# EAGLE design STorM32 NT motor v11 (EAGLE 6.5.0)
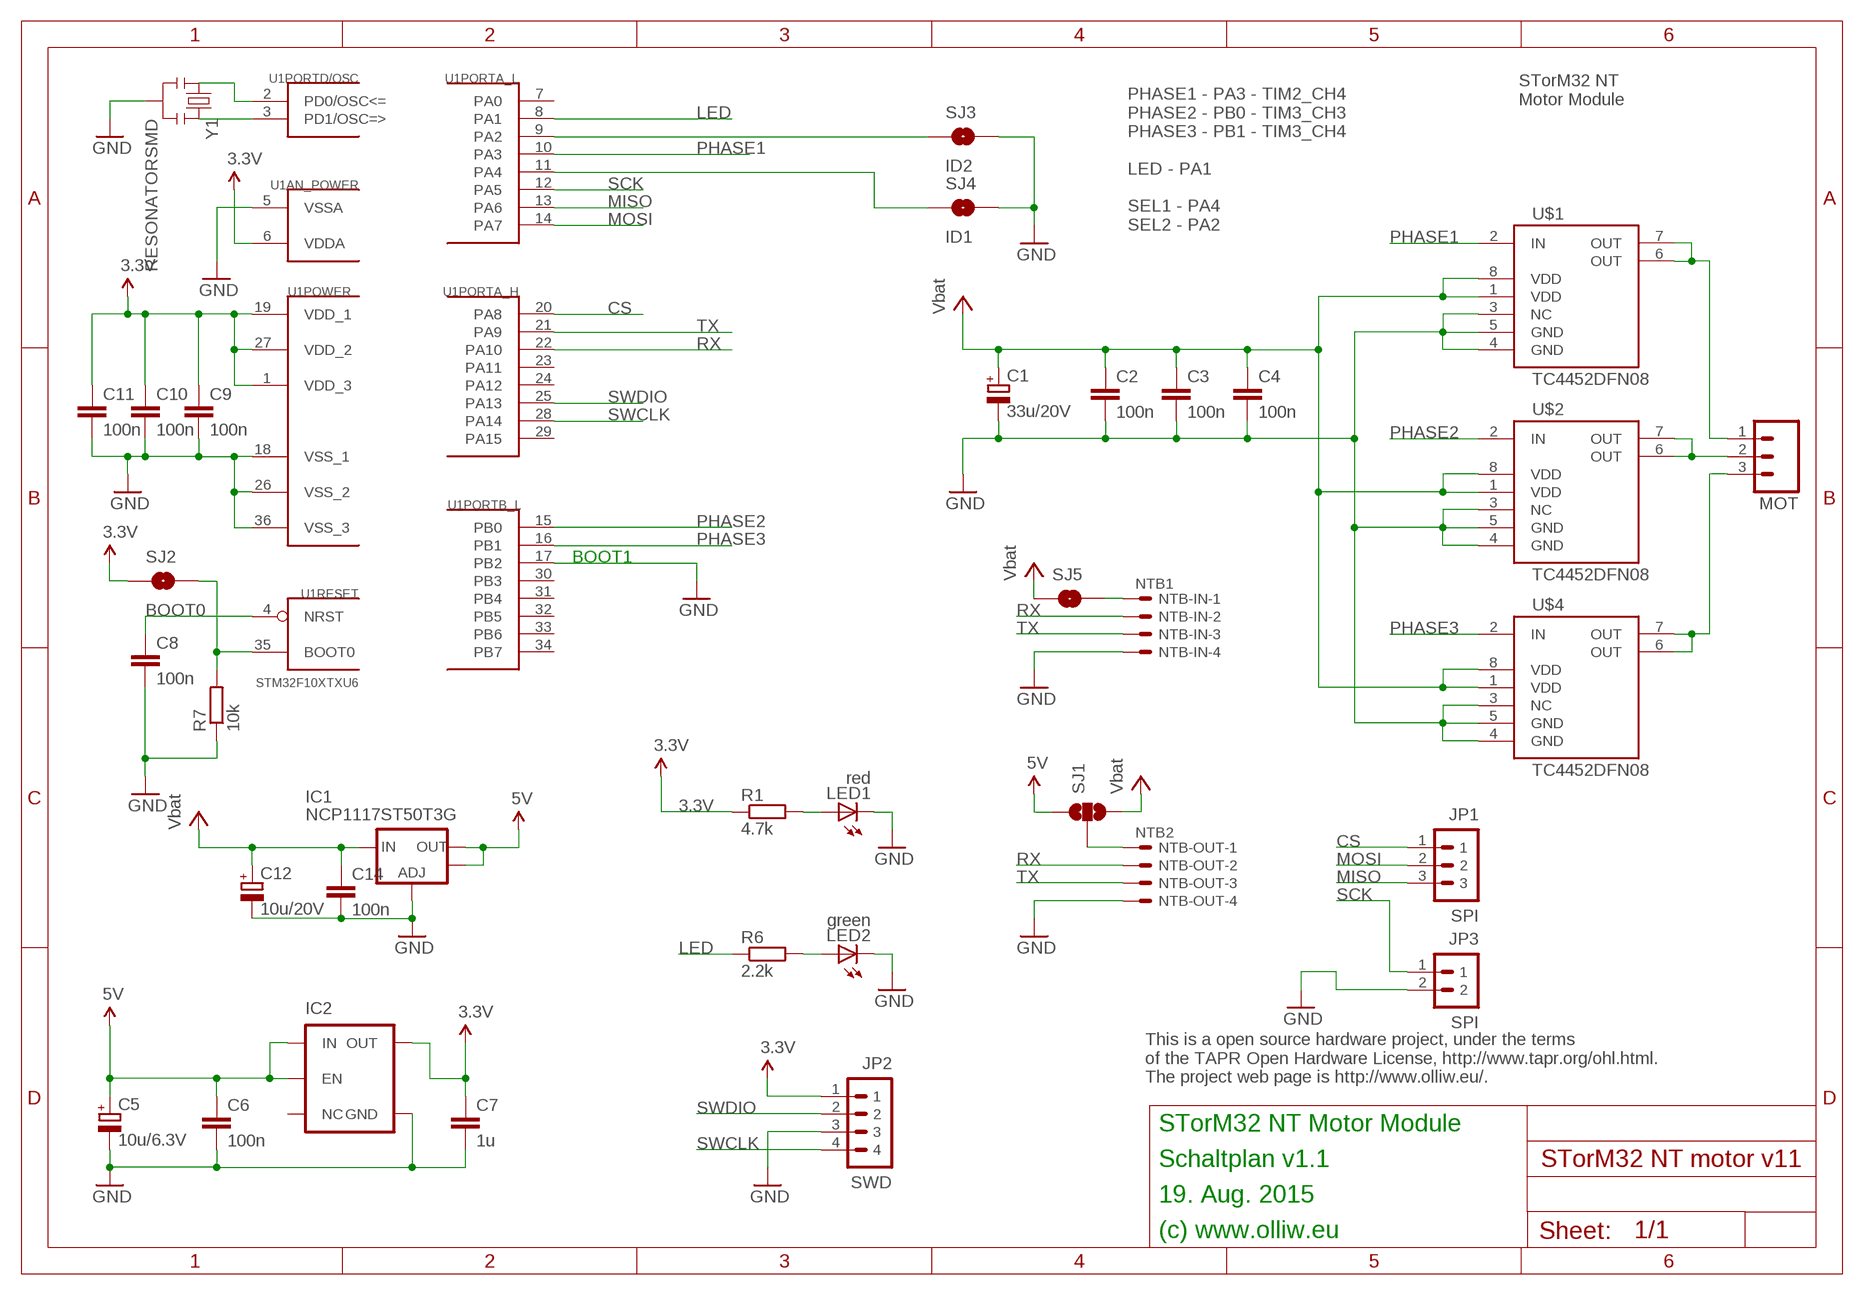
[diagram p0: schematic, sheet 1]

## Parts
C1  33u/20V  CPOL-EUSMCC  [SMC_C]
C2  100n  C-EUC0603  [C0603]
C3  100n  C-EUC0603  [C0603]
C4  100n  C-EUC0603  [C0603]
C5  10u/6.3V  CPOL-EUSMCB  [SMC_B]
C6  100n  C-EUC0603  [C0603]
C7  1u  C-EUC0603  [C0603]
C8  100n  C-EUC0603  [C0603]
C9  100n  C-EUC0603  [C0603]
C10  100n  C-EUC0603  [C0603]
C11  100n  C-EUC0603  [C0603]
C12  10u/20V  CPOL-EUSMCB  [SMC_B]
C14  100n  C-EUC0603  [C0603]
IC1  NCP1117ST50T3G  V_REG_LM1117SOT223  [SOT223]
IC2  V_REG_TPS76433SOT23-5  [SOT23-5]
JP1  SPI  P3X1_1P27-OCT_BILEX  [3X1_1P27_OCT_BILEX]
JP2  SWD  P4X1_1P27-OCT_BILEX  [4X1_1P27_OCT_BILEX]
JP3  SPI  P2X1_1P27-OCT_BILEX  [2X1_1P27_OCT_BILEX]
LED1  red  LEDCHIPLED_0603  [CHIPLED_0603]
LED2  green  LEDCHIPLED_0603  [CHIPLED_0603]
MOT  M03PTH  [1X03]
NTB-IN  NTB1  SM04B-SRSS-TB  [SM04B-SRSS-TB]
NTB-OUT  NTB2  SM04B-SRSS-TB  [SM04B-SRSS-TB]
R1  4.7k  R-EU_R0603  [R0603]
R6  2.2k  R-EU_R0603  [R0603]
R7  10k  R-EU_R0603  [R0603]
SJ1  SOLDERJUMPER_2WAYT  [SJ_2]
SJ2  BOOT0  SOLDERJUMPERNO  [SJ_2S-NO]
SJ3  ID2  SOLDERJUMPERNO  [SJ_2S-NO]
SJ4  ID1  SOLDERJUMPERNO  [SJ_2S-NO]
SJ5  SOLDERJUMPER  [SJ_1T]
U1  STM32F10XTXU6  [VFQFPN36]
U$1  TC4452DFN08  [DFN8]
U$2  TC4452DFN08  [DFN8]
U$4  TC4452DFN08  [DFN8]
Y1  RESONATORSMD  [RESONATOR-SMD]

## Nets
3.3V: C7.1 C9.1 C10.1 C11.1 IC2.5(OUT) JP2.1 R1.1 SJ2.1 U1.1(POWER:VDD_3) U1.6(AN_POWER:VDDA) U1.19(POWER:VDD_1) U1.27(POWER:VDD_2)
5V: C5.+ C6.1 IC1.2(OUT) IC1.4(OUT) IC2.1(IN) IC2.3(EN) SJ1.1
CS: JP1.1 U1.20(PORTA_H:PA8)
GND: C1.- C2.2 C3.2 C4.2 C5.- C6.2 C7.2 C8.2 C9.2 C10.2 C11.2 C12.- C14.2 IC1.1(ADJ) IC2.2(GND) JP2.3 JP3.2 LED1.C LED2.C NTB-IN.4 NTB-OUT.4 R7.1 SJ3.2 SJ4.2 U1.5(AN_POWER:VSSA) U1.17(PORTB_L:PB2) U1.18(POWER:VSS_1) U1.26(POWER:VSS_2) U1.36(POWER:VSS_3) U$1.3(NC) U$1.4(GND) U$1.5(GND) U$2.3(NC) U$2.4(GND) U$2.5(GND) U$4.3(NC) U$4.4(GND) U$4.5(GND) Y1.2
LED: R6.1 U1.8(PORTA_L:PA1)
MISO: JP1.3 U1.13(PORTA_L:PA6)
MOSI: JP1.2 U1.14(PORTA_L:PA7)
N$1: MOT.2 U$2.6(OUT) U$2.7(OUT)
N$2: NTB-OUT.1 SJ1.2
N$5: MOT.1 U$1.6(OUT) U$1.7(OUT)
N$6: MOT.3 U$4.6(OUT) U$4.7(OUT)
N$7: C8.1 U1.4(RESET:NRST)
N$8: R7.2 SJ2.2 U1.35(RESET:BOOT0)
N$9: U1.2(PORTD/OSC:PD0/OSC<=) Y1.1
N$10: U1.3(PORTD/OSC:PD1/OSC=>) Y1.3
N$11: LED1.A R1.2
N$12: LED2.A R6.2
N$13: NTB-IN.1 SJ5.3
PHASE1: U1.10(PORTA_L:PA3) U$1.2(IN)
PHASE2: U1.15(PORTB_L:PB0) U$2.2(IN)
PHASE3: U1.16(PORTB_L:PB1) U$4.2(IN)
RX: NTB-IN.2 NTB-OUT.2 U1.22(PORTA_H:PA10)
SCK: JP3.1 U1.12(PORTA_L:PA5)
SEL1: SJ4.1 U1.11(PORTA_L:PA4)
SEL2: SJ3.1 U1.9(PORTA_L:PA2)
SWCLK: JP2.4 U1.28(PORTA_H:PA14)
SWDIO: JP2.2 U1.25(PORTA_H:PA13)
TX: NTB-IN.3 NTB-OUT.3 U1.21(PORTA_H:PA9)
VBAT: C1.+ C2.1 C3.1 C4.1 C12.+ C14.1 IC1.3(IN) SJ1.3 SJ5.1 U$1.1(VDD) U$1.8(VDD) U$2.1(VDD) U$2.8(VDD) U$4.1(VDD) U$4.8(VDD) ; supply symbol labelled Vbat
Unconnected: IC2.4(NC) U1.7(PORTA_L:PA0) U1.23(PORTA_H:PA11) U1.24(PORTA_H:PA12) U1.29(PORTA_H:PA15) U1.30(PORTB_L:PB3) U1.31(PORTB_L:PB4) U1.32(PORTB_L:PB5) U1.33(PORTB_L:PB6) U1.34(PORTB_L:PB7)

## Notes on the sheet
- PHASE1 - PA3 - TIM2_CH4
  PHASE2 - PB0 - TIM3_CH3
  PHASE3 - PB1 - TIM3_CH4
  
  LED - PA1
  
  SEL1 - PA4
  SEL2 - PA2
- STorM32 NT
  Motor Module
- BOOT1
- This is a open source hardware project, under the terms
  of the TAPR Open Hardware License, http://www.tapr.org/ohl.html.
  The project web page is http://www.olliw.eu/.
- STorM32 NT Motor Module
- Schaltplan v1.1
- 19. Aug. 2015
- (c) www.olliw.eu

## Library data of the parts
C1 C5 C12 = rcl:CPOL-EU: POLARIZED CAPACITOR, European symbol
C2-C4 C6-C11 C14 = rcl:C-EU: CAPACITOR, European symbol
IC1 = # SparkFun2:V_REG_LM1117: Voltage Regulator LM1117 Standard adjustable voltage regulator but in SMD form. Spark Fun Electronics SKU : COM-00595
IC2 = # SparkFun2:V_REG_TPS76433: Voltage Regulator Older TI part. LDO 150mA regulator. No output by-pass cap option. See V_REG_LDO for a better part.
JP1 = # stdlib:P3X1_1P27: PinHead 1.27mm - LONG 1.0x0.5
JP2 = # stdlib:P4X1_1P27
JP3 = # stdlib:P2X1_1P27
LED1 LED2 = led:LED: LED OSRAM: - CHIPLED LG R971, LG N971, LY N971, LG Q971, LY Q971, LO R971, LY R971 LH N974, LH R974 LS Q976, LO Q976, LY Q976 LO Q996 - Hyper CHIPLED LW Q18S LB Q993, LB Q99A, LB R99A - SideLED LS A670, LO A670, LY A670, LG A670, LP A670 LB A673, LV A673, LT A673, LW A673 LH A674 LY A675 LS A676, LA A676, LO A676, LY A676, LW A676 LS A679, LY A679, LG A679 - Hyper Micro SIDELED® LS Y876, LA Y876, LO Y876, LY Y876 LT Y87S - SmartLED LW L88C, LW L88S LB L89C, LB L89S, LG L890 LS L89K, LO L89K, LY L89K LS L896, LA L896, LO L896, LY L896 - TOPLED LS T670, LO T670, LY T670, LG T670, LP T670 LSG T670, LSP T670, LSY T670, LOP T670, LYG T670 LG T671, LOG T671, LSG T671 LB T673, LV T673, LT T673, LW T673 LH T674 LS T676, LA T676, LO T676, LY T676, LB T676, LH T676, LSB T676, LW T676 LB T67C, LV T67C, LT T67C, LS T67K, LO T67K, LY T67K, LW E67C LS E67B, LA E67B, LO E67B, LY E67B, LB E67C, LV E67C, LT E67C LW T67C LS T679, LY T679, LG T679 LS T770, LO T770, LY T770, LG T770, LP T770 LB T773, LV T773, LT T773, LW T773 LH T774 LS E675, LA E675, LY E675, LS T675 LS T776, LA T776, LO T776, LY T776, LB T776 LHGB T686 LT T68C, LB T68C - Hyper Mini TOPLED® LB M676 - Mini TOPLED Santana® LG M470 LS M47K, LO M47K, LY M47K Source: http://www.osram.convergy.de LUXEON: - LUMILED® LXK2-PW12-R00, LXK2-PW12-S00, LXK2-PW14-U00, LXK2-PW14-V00 LXK2-PM12-R00, LXK2-PM12-S00, LXK2-PM14-U00 LXK2-PE12-Q00, LXK2-PE12-R00, LXK2-PE12-S00, LXK2-PE14-T00, LXK2-PE14-U00 LXK2-PB12-K00, LXK2-PB12-L00, LXK2-PB12-M00, LXK2-PB14-N00, LXK2-PB14-P00, LXK2-PB14-Q00 LXK2-PR12-L00, LXK2-PR12-M00, LXK2-PR14-Q00, LXK2-PR14-R00 LXK2-PD12-Q00, LXK2-PD12-R00, LXK2-PD12-S00 LXK2-PH12-R00, LXK2-PH12-S00 LXK2-PL12-P00, LXK2-PL12-Q00, LXK2-PL12-R00 Source: www.luxeon.com KINGBRIGHT: KA-3528ASYC Source: www.kingbright.com
MOT = # SparkFun:M03: Header 3 Standard 3-pin 0.1" header. Use with straight break away headers (SKU : PRT-00116), right angle break away headers (PRT-00553), swiss pins (PRT-00743), machine pins (PRT-00117), and female headers (PRT-00115). Molex polarized connector foot print use with SKU : PRT-08232 with associated crimp pins and housings.
NTB-IN NTB-OUT = con-jst2:?M04B-SRSS-TB: Disconnectable Crimp style connector, 1.0mm pitch 4 contacts
R1 R6 R7 = rcl:R-EU_: RESISTOR, European symbol
SJ1 = # SparkFun2:SOLDERJUMPER_2WAY: Solder Jumper 2 way solder jumper
SJ2-SJ5 = # SparkFun2:SOLDERJUMPER: Solder Jumper Standard SMD solder jumper. Used to automate production. Two varients : Normally Open and Normally Closed are the same, but have different paste layers. NC will have a large amount of paste and should jumper during reflow.
U1 = # stm32:STM32F10XTXU6: STM32F101/103 36pad VFQPFN36
U$1 U$2 U$4 = # stdlib:TC4452
Y1 = # SparkFun2:RESONATOR: Resonator Small SMD resonator. This is the itty bitty 10/20MHz resonators with built in caps. CSTCE10M0G55 and CSTCE20M0V53. Footprint has been reviewed closely but hasn't been tested yet.

## Board
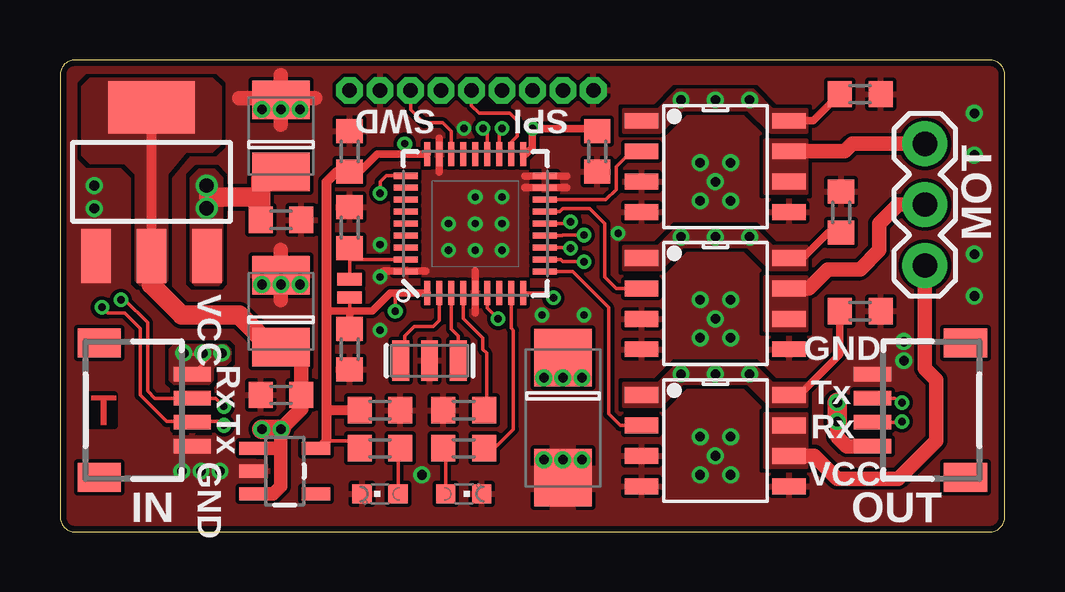
[diagram p1: board, top side]
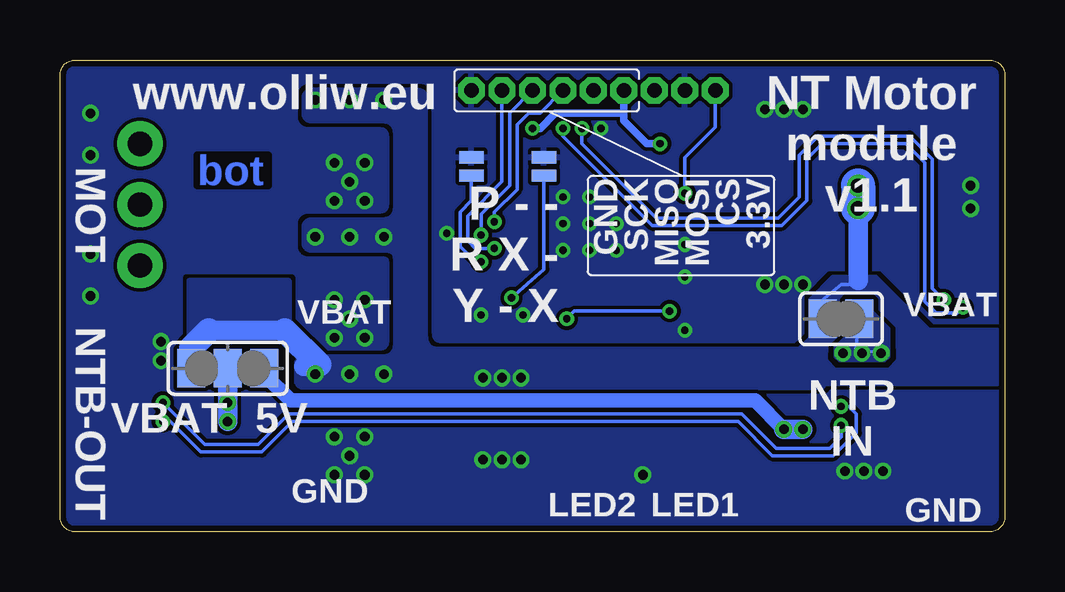
[diagram p2: board, bottom side, seen from below]

Size 39.37 x 19.68 mm. Coordinates in mm from the lower left corner, seen from the top.
Outline: 0.64,0 38.73,0 arc90 39.37,0.64 39.37,19.05 arc90 38.73,19.68 0.64,19.68 arc90 0,19.05 0,0.64 arc90 0.64,0
Copper layers (1*16): Top 0.035mm / dielectric 1.5mm / Bottom 0.035mm
Design rules "Fusion_eagle_rule_v1.1-shapes-supply-changed": minimum track width 6mil, minimum drill 12mil, track to track 6mil, track to pad 6mil, pad to pad 6mil, via to via 6mil, smd to smd 0mil, copper to edge 10mil, drill to drill 10mil, minimum pad ring 10mil, minimum via ring 6mil, stop-mask expansion 2mil, vias tented up to drill 100mil, thermal gap 6mil

### Footprints (pad centres in the part's own frame; a part is rotated, then mirrored left to right if it is on the bottom)
SMC_C = smd 2.4 x 2.4: + -2.5,0; - 2.5,0
C0603 = smd 1 x 1.1: 1 -0.85,0; 2 0.85,0
SMC_B = smd 1.6 x 2.4: + -1.5,0; - 1.5,0
SOT223 = smd 1.219 x 2.235: 1 -2.311,-3.099; 2 0,-3.099; 3 2.311,-3.099 | smd 3.6 x 2.2: 4 0,3.099
SOT23-5 = smd 0.55 x 1.2: 1 -0.95,-1.3; 2 0,-1.3; 3 0.95,-1.3; 4 0.95,1.3; 5 -0.95,1.3
3X1_1P27_OCT_BILEX = drill 0.61 pad 1.118 octagon: 1 0,0; 2 0,-1.27; 3 0,-2.54
4X1_1P27_OCT_BILEX = drill 0.61 pad 1.118 octagon: 1 0,0; 2 0,-1.27; 3 0,-2.54; 4 0,-3.81
2X1_1P27_OCT_BILEX = drill 0.61 pad 1.118 octagon: 1 0,0; 2 0,-1.27
CHIPLED_0603 = smd 0.8 x 0.8: A 0,-0.75; C 0,0.75
1X03 = drill 1.016 pad 1.88: 1 0,0; 2 2.54,0; 3 5.08,0
SM04B-SRSS-TB = smd 0.6 x 1.55: 1 -1.5,2.975; 2 -0.5,2.975; 3 0.5,2.975; 4 1.5,2.975 | smd 1.2 x 1.8: FIT@1 -2.8,-0.9; FIT@2 2.8,-0.9
R0603 = smd 1 x 1.1: 1 -0.85,0; 2 0.85,0
SJ_2 = smd 1.168 x 1.6: 1 -1.524,0; 2 0,0; 3 1.524,0
SJ_2S-NO = smd 0.508 x 1.016: 1 -0.381,0; 2 0.381,0
SJ_1T = smd 1.168 x 1.6: 1 -0.762,0; 3 0.762,0
VFQFPN36 = smd 1 x 0.25: 1 -2.9,2; 2 -2.9,1.5; 3 -2.9,1; 4 -2.9,0.5; 5 -2.9,0; 6 -2.9,-0.5; 7 -2.9,-1; 8 -2.9,-1.5; 9 -2.9,-2; 19 2.9,-2; 20 2.9,-1.5; 21 2.9,-1; 22 2.9,-0.5; 23 2.9,0; 24 2.9,0.5; 25 2.9,1; 26 2.9,1.5; 27 2.9,2 | smd 0.25 x 1: 10 -2,-2.9; 11 -1.5,-2.9; 12 -1,-2.9; 13 -0.5,-2.9; 14 0,-2.9; 15 0.5,-2.9; 16 1,-2.9; 17 1.5,-2.9; 18 2,-2.9; 29 1.5,2.9; 30 1,2.9; 31 0.5,2.9; 32 0,2.9; 33 -0.5,2.9; 34 -1,2.9; 35 -1.5,2.9; 36 -2,2.9 | smd 0.27 x 1: 28 2,2.9
DFN8 = smd 0.66 x 1.397: 1 0,-3.073; 2 1.27,-3.073; 3 2.54,-3.073; 4 3.81,-3.073; 5 3.81,3.073; 6 2.54,3.073; 7 1.27,3.073; 8 0,3.073
RESONATOR-SMD = smd 0.7 x 1.7: 1 -1.2,0; 2 0,0; 3 1.2,0

### Placement (x,y rotation side)
C1  20.95,4.76 270 top
C2  33.34,18.26 0 top
C3  32.54,13.34 90 top
C4  33.34,9.21 0 top
C5  9.21,9.21 90 top
C6  9.21,5.71 180 top
C7  13.34,5.08 0 top
C8  16.83,5.08 180 top
C9  12.06,7.62 270 top
C10  22.38,15.88 270 top
C11  12.06,15.88 90 top
C12  9.21,16.51 90 top
C14  9.21,13.02 0 top
IC1  3.81,14.61 0 top
IC2  9.37,2.54 270 top
JP1  17.14,18.41 90 top
JP2  15.88,18.41 270 top
JP3  20.95,18.41 90 top
LED1  13.34,1.59 90 top
LED2  16.83,1.59 270 top
MOT  36.04,11.11 90 top
NTB-IN  2.54,5.08 270 top
NTB-OUT  36.83,5.08 90 top
R1  13.34,3.49 0 top
R6  16.83,3.49 180 top
R7  12.06,12.7 270 top
SJ1  32.38,6.83 180 bottom
SJ2  12.06,10.16 90 top
SJ3  19.21,15.24 90 bottom
SJ4  22.23,15.24 90 bottom
SJ5  6.83,8.89 0 bottom
U1  17.3,12.86 90 top
U$1  27.3,5.71 270 top
U$2  27.3,11.43 270 top
U$4  27.3,17.14 270 top
Y1  15.4,7.14 0 top

### Tracks (layer width: path | path; a pad name or v marks a point on that pad's centre or on a via)
3.3V  (via drill 0.3)
  Top 0.152: U1.6 17.8,9.34 v18.26,8.89 | v13.97,9.21 13.97,9.96 | 11.21,9.86 11.11,10.95 | 11.11,3.81 12.17,3.81 R1.1 | SJ2.1 12.06,9.21 | 22.28,16.83 C10.1
  Top 0.305: U1.1 13.97,9.96 13.77,9.96 13.02,9.21 12.06,9.21 | 12.06,9.21 11.11,9.21 | C11.1 12.48,15.03 13.22,15.76 14.37,15.76 | v14.37,16.19 14.37,15.76 | C9.1 12.06,9.21 | U1.27 14.37,15.76 | U1.19 19.41,15.76 19.68,16.03 v19.68,16.83 22.28,16.83
  Top 0.406: 11.11,5.4 11.11,4.92 11.11,3.81 10.79,3.49 IC2.5 | 11.11,5.4 11.11,8.89 11.11,9.21 11.11,10.95 11.11,14.61 11.53,15.03 C11.1 | C7.1 11.11,5.08 11.11,5.4
  Bottom 0.152: v18.26,8.89 17.94,9.21 v13.97,9.21
  Bottom 0.305: 15.88,17.46 18.73,17.46 19.37,16.83 v19.68,16.83 | JP2.1 15.88,17.46 | v14.37,16.19 14.92,16.19 15.88,17.14 15.88,17.46
5V  (via drill 0.4)
  Top 0.152: 10.06,7.56 9.84,7.78 9.28,7.78 C5.+ | 8.89,3.49 9.21,3.65
  Top 0.406: IC1.4 IC1.2
  Top 0.559: IC2.3 8.89,1.59 9.21,1.91 9.21,3.65 v9.21,4.29 | IC2.1 8.89,3.49
  Top 0.61: 10.06,7.56 C6.1 10.06,5.14 v9.21,4.29
  Top 0.813: IC1.2 3.81,10.32 5.08,9.05 7.46,9.05 8.89,7.62 C5.+ | v8.41,4.29 v9.21,4.29
  Bottom 0.61: SJ1.1 30.86,6.57 29.77,5.48 10.4,5.48 v9.21,4.29
  Bottom 0.813: v8.41,4.29 v9.21,4.29
  pour Top (no thermals): 0.95,18.57 1.27,18.89 6.35,18.89 6.67,18.57 6.67,16.19 6.35,15.88 5.24,15.88 4.45,14.92 4.45,10.48 4.29,10.32 3.33,10.32 3.17,10.48 3.17,14.92 2.7,15.4 1.27,15.4 0.95,15.72
CS
  Top 0.152: JP1.1 17.14,17.78 17.46,17.46 18.73,17.46 19.05,17.14 19.05,16.51 18.8,16.26 U1.20
GND  (via drill 0.3, 0.4)
  Top 0.305: 19.37,14.37 21.11,14.37 | 19.37,14.84 21.11,14.84 | 15.24,10.87 13.49,10.87 | 17.3,9.13 17.3,10.87 | 15.8,15 15.8,16.43
  Top 0.61: 7.46,18.1 10.64,18.1 | 9.21,9.68 9.21,11.75 | 9.21,16.99 9.21,19.05
  other vias: 27.94,2.38 26.67,3.97 27.94,3.97 26.67,2.38 27.3,3.17 27.94,8.1 26.67,9.68 27.94,9.68 26.67,8.1 27.3,8.89 27.94,13.81 26.67,15.4 27.94,15.4 26.67,13.81 27.3,14.61 13.34,11.99 13.34,10.64 21.75,3.02 20.95,3.02 20.16,3.02 1.43,13.49 1.43,14.45 8.41,17.62 9.21,17.62 10,17.62 10,10.32 9.21,10.32 8.41,10.32 5.08,2.54 5.87,2.54 35.16,7.94 23.26,12.46 21.83,9.05 20.08,9.05 17.3,12.86 16.19,11.75 18.41,11.75 18.41,12.86 17.3,11.75 16.19,12.86 17.3,13.97 13.34,8.41 15.08,2.38 38.1,11.59 38.1,15.72 38.1,17.46 38.1,9.84 35.16,7.14 6.67,2.54 18.41,13.97 16.83,16.83
  pour Top (isolate 0.152, rank 6): 39.37,19.68 0,19.68 0,0 39.37,0
  pour Bottom (isolate 0.152, rank 6): 39.37,0 0,0 0,19.68 39.37,19.68
  pour Top (no thermals): 19.37,2.7 22.54,2.7 22.54,1.75 19.37,1.75
  pour Top (no thermals): 20.48,0.64 20.48,3.65 21.43,3.65 21.43,0.64
  pour Top (no thermals): 4.29,3.97 6.67,3.97 6.67,2.86 4.29,2.86
  pour Top (no thermals): 0.64,13.18 0.64,10.16 2.38,10.16 2.38,13.18
  pour Top (no thermals): 32.7,7.14 32.7,6.03 34.92,6.03 34.92,7.14
  pour Top (no thermals): 6.67,3.02 8.41,3.02 8.57,2.86 8.57,2.22 8.41,2.06 6.67,2.06
LED
  Top 0.152: R6.1 18.15,3.55 18.89,4.29 18.89,8.41 18.8,8.5 U1.8
MISO  (via drill 0.3)
  Top 0.152: U1.13 20.93,12.36 20.95,12.38 v21.83,12.38
  Bottom 0.152: v21.83,12.38 21.83,13.26 20.64,14.45 20.64,17.46 JP1.3
MOSI  (via drill 0.3)
  Top 0.152: U1.14 21.19,12.86 v21.27,12.94
  Bottom 0.152: v21.27,12.94 21.27,13.34 20.32,14.29 20.32,16.99 19.84,17.46 19.37,17.46 JP1.2
N$1
  Top 0.61: U$2.7 31.19,10.16 31.99,10.95 33.34,10.95 34.13,11.75 34.13,12.86 34.92,13.65 MOT.2
  pour Top (no thermals): 29.37,10.64 31.11,10.64 31.11,8.41 29.37,8.41
N$2  (via drill 0.4)
  Top 0.61: NTB-OUT.1 32.79,3.58 32.38,3.97 v32.38,4.6
  Top 0.813: v32.38,4.6 v32.38,5.4
  Bottom 0.813: SJ1.2 v32.38,5.4 v32.38,4.6
N$5
  Top 0.61: MOT.1 36.04,6.83 36.51,6.35 36.51,3.81 34.92,2.22 32.38,2.22 31.43,3.17 U$1.6
  pour Top (no thermals): 29.37,4.92 31.11,4.92 31.11,2.7 29.37,2.7
N$6
  Top 0.61: U$4.7 32.7,15.88 33.02,16.19 MOT.3
  pour Top (no thermals): 29.37,16.35 31.11,16.35 31.11,14.13 29.37,14.13
N$7
  Top 0.152: U1.4 16.8,8.91 17.62,8.1 17.62,7.62 17.78,7.46 17.78,5.45 C8.1
N$8
  Top 0.152: R7.2 12.06,11.36 | 12.06,11.36 SJ2.2 | U1.35 12.06,11.36
N$9
  Top 0.152: U1.2 15.8,8.82 15.56,8.57 14.76,8.57 14.36,8.17 14.36,7.78 Y1.1
N$10
  Top 0.152: U1.3 16.3,8.46 16.6,8.17 Y1.3
N$11
  Top 0.152: LED1.A 14.09,3.39 R1.2
N$12
  Top 0.152: LED2.A 16.08,3.39 R6.2
N$13  (via drill 0.4)
  Top 0.152: v5.16,7.46 6.24,7.3 NTB-IN.1
  Bottom 0.152: SJ5.3 6.22,7.59 v5.16,7.46
  other vias: 5.95,7.46 6.75,7.46
  pour Top (no thermals): 4.76,7.78 6.91,7.78 7.06,7.62 7.06,7.14 6.91,6.99 6.51,6.99 6.35,6.83 6.35,6.35 6.19,6.19 4.76,6.19 4.6,6.35 4.6,7.62
  pour Bottom (no thermals): 4.84,8.49 4.84,7.3 5,7.14 6.91,7.14 7.06,7.3 7.06,7.7 5.56,9.21
PHASE1
  Top 0.152: U$1.2 23.34,4.45 22.86,4.92 22.86,9.37 21.37,10.86 U1.10
PHASE2
  Top 0.152: U$2.2 23.18,10.16 22.7,10.64 22.7,12.86 22.07,13.49 20.95,13.49 20.82,13.36 U1.15
PHASE3
  Top 0.152: U1.16 22.75,13.86 23.18,14.29 23.18,15.24 23.81,15.88 U$4.2
RX  (via drill 0.3)
  Top 0.152: v2.54,9.68 2.7,9.68 3.65,8.73 3.65,5.87 3.94,5.58 NTB-IN.2 6.49,5.58 v6.83,5.24 | NTB-OUT.2 34.79,4.58 v35.08,4.6 | U1.22 17.8,16.64 v17.62,16.83
  Bottom 0.152: v2.54,9.68 3.02,10.16 3.02,15.56 3.97,16.51 7.78,16.51 8.57,15.72 8.57,13.97 9.45,13.1 14.53,13.1 17.62,16.19 v17.62,16.83 | v35.08,4.6 34.77,4.6 33.5,3.33 30.96,3.33 29.69,4.6 11.11,4.6 9.68,3.17 7.14,3.17 6.19,4.13 6.19,4.92 6.51,5.24 v6.83,5.24
SCK  (via drill 0.3)
  Top 0.152: U1.12 21.24,11.86 v21.27,11.83
  Bottom 0.152: v21.27,11.83 22.07,11.83 22.38,12.14 22.38,13.18 20.95,14.61 JP3.1
SEL1  (via drill 0.3)
  Top 0.152: U1.11 20.87,11.36 20.95,11.27 v21.83,11.27
  Bottom 0.152: v21.83,11.27 22.07,11.27 22.7,11.91 22.7,13.34 22.23,13.81 SJ4.1
SEL2  (via drill 0.3)
  Top 0.152: U1.9 20.36,9.96 v20.56,9.76
  Bottom 0.152: v20.56,9.76 19.21,10.95 SJ3.1
SWCLK  (via drill 0.3)
  Top 0.152: U1.28 13.59,14.86 13.34,14.61 v13.34,14.13
  Bottom 0.152: v13.34,14.13 13.34,15.62 12.06,16.89 JP2.4
SWDIO
  Top 0.152: JP2.2 14.61,17.62 15.16,17.07 15.95,17.07 16.3,16.72 U1.25
TX  (via drill 0.3)
  Top 0.152: NTB-IN.3 5.58,4.58 5.71,4.6 | v1.75,9.37 1.98,9.13 2.7,9.13 3.33,8.49 3.33,5.71 4.45,4.6 5.71,4.6 | NTB-OUT.3 34.79,5.58 v35.08,5.4 | 5.71,4.6 6.67,4.6 v6.83,4.45 | U1.21 18.3,16.72 v18.41,16.83
  Bottom 0.152: v1.75,9.37 1.98,9.13 2.86,9.13 3.33,9.6 3.33,15.4 4.13,16.19 7.62,16.19 8.26,15.56 8.26,13.81 9.29,12.78 14.68,12.78 18.41,16.51 v18.41,16.83 | v35.08,5.4 33.34,3.65 31.11,3.65 29.84,4.92 10.95,4.92 9.53,3.49 7.3,3.49 6.83,3.97 v6.83,4.45
VBAT  (via drill 0.4, 0.6)
  Top 0.152: v20.95,6.43 C1.+ | v6.11,13.49 v6.11,14.45 6.11,14.05 6.19,13.97 | 8.36,14.71 8.41,14.76 8.96,14.76 C12.+
  Top 0.305: U$4.8 31.38,17.14 C2.1 | C4.1 32.49,7.41 30.8,5.71 U$1.8 | C3.1 32.01,12.48 30.96,11.43 U$2.8
  Top 0.406: 6.12,13.4 v6.11,13.49
  Top 0.813: C14.1 8.36,13.97 | 8.36,13.97 8.36,14.71 | 6.19,13.97 8.36,13.97
  Bottom 0.152: 29.21,6.91 v28.73,6.59 | SJ5.1 7.75,9.56 6.83,10.32 6.19,10.32 6.19,10.4 6.11,10.48
  Bottom 0.813: v6.11,13.49 6.11,10.48 | 33.18,8.41 30,8.41 | 28.57,6.99 29.21,6.91
  Bottom 1.016: SJ1.3 33.91,7.68 33.18,8.41 | 30,8.41 28.57,6.99
  Bottom 1.422: v6.11,14.45 v6.11,13.49
  other vias: 27.3,18.02 25.88,18.02 28.73,18.02 27.3,12.3 25.88,12.3 28.73,12.3 27.3,6.59 25.88,6.59 21.75,6.43 20.16,6.43
  pour Bottom: 29.21,18.1 29.21,17.46 arc-90 28.89,17.14 25.88,17.14 arc90 25.4,16.67 25.4,13.49 arc90 25.88,13.02 28.89,13.02 arc-90 29.21,12.7 29.21,12.06 arc-90 28.89,11.75 25.72,11.75 arc90 25.4,11.43 25.4,7.78 arc90 25.88,7.3 29.21,7.3 arc-90 29.53,6.99 29.53,6.35 arc-90 29.21,6.03 7.62,6.03 7.46,6.19 0.32,6.19 0.32,8.41 4.45,8.41 4.45,7.14 4.84,6.75 7.06,6.75 7.46,7.14 7.46,7.62 23.65,7.62 arc90 24.13,8.1 24.13,18.1 arc-90 24.45,18.41 28.89,18.41 arc-90
  pour Top (no thermals): 31.11,16.67 29.61,16.67 28.65,17.62 25.96,17.62 25,16.67 23.5,16.67 23.5,17.62 24.92,17.62 25.72,18.41 28.89,18.41 29.69,17.62 31.11,17.62
  pour Top (no thermals): 31.11,10.95 29.61,10.95 28.65,11.91 25.96,11.91 25,10.95 23.5,10.95 23.5,11.91 24.92,11.91 25.72,12.7 28.89,12.7 29.69,11.91 31.11,11.91
  pour Top (no thermals): 31.11,5.24 29.61,5.24 28.65,6.19 25.96,6.19 25,5.24 23.5,5.24 23.5,6.19 24.92,6.19 25.72,6.99 28.89,6.99 29.69,6.19 31.11,6.19
  pour Top (no thermals): 5.64,10.32 5.48,10.48 5.48,14.76 5.79,15.08 6.43,15.08 6.75,14.76 6.75,10.48 6.59,10.32
  pour Bottom: 29.84,10.48 29.84,8.18 33.97,8.18 33.97,10.48
  pour Bottom (no thermals): 4.45,7.7 4.45,8.57 5.16,9.29 5.16,9.76 5.4,10 6.75,10 6.99,9.76 6.99,8.26 7.46,7.78 7.46,7.54 8.73,7.46 8.1,8.1 8.1,9.68 7.14,10.64 5.4,10.64 3.02,8.26 2.86,7.78

### Text on the board
Top: T
Bottom: bot
tNames: SWD | SPI | MOT | VCC | GND | Rx | Tx | Tx | Rx | GND | VCC | IN | OUT
bNames: NT Motor / module / v1.1 | www.olliw.eu | 3.3V | CS | MOSI | MISO | SCK | GND | MOT | P - - / R X - / Y - X | VBAT | VBAT | NTB-OUT | NTB / IN | 5V | VBAT | GND | GND | LED1 | LED2